# EAGLE design LimitSwitch (EAGLE 9.4.2)
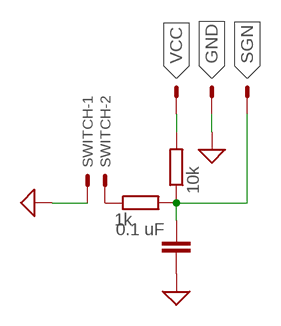
[diagram p0: schematic, sheet 1]

## Parts
C1  0.1 uF  C-EUC1206  [C1206]
INPUT  22-23-2031  [22-23-2031]
R3  10k  R-EU_R1206  [R1206]
R4  1k  R-EU_R1206  [R1206]
SWITCH  22-23-2021  [22-23-2021]

## Nets
GND: C1.2 INPUT.2 SWITCH.1 ; supply symbol labelled SUP
N$1: R4.1 SWITCH.2
SGN: C1.1 INPUT.3 R3.1 R4.2
VCC: INPUT.1 R3.2

## Library data of the parts
C1 = rcl:C-EU: CAPACITOR, European symbol; SPICEPREFIX: C
INPUT = con-molex:22-23-2031: .100" (2.54mm) Center Header - 3 Pin; MF: MOLEX; MPN: 22-23-2031; OC_FARNELL: 1462950; OC_NEWARK: 30C0862
R3 R4 = rcl:R-EU_: RESISTOR, European symbol; SPICEPREFIX: R
SWITCH = con-molex:22-23-2021: .100" (2.54mm) Center Header - 2 Pin; MF: MOLEX; MPN: 22-23-2021; OC_FARNELL: 1462926; OC_NEWARK: 25C3832

## Board
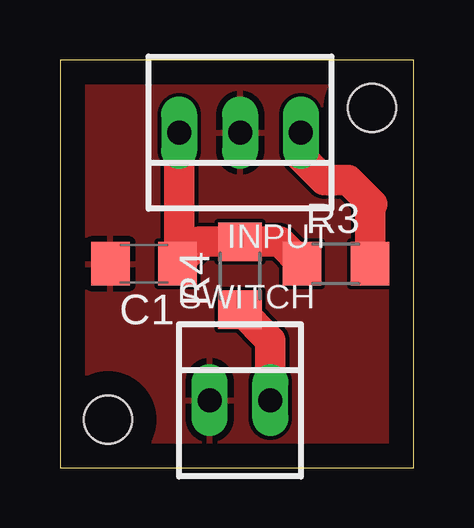
[diagram p1: board, top side]

Size 14.73 x 17 mm. Coordinates in mm from the lower left corner, seen from the top.
Outline: 0,0 14.73,0 14.73,16.99 0,17 0,0
Copper layers (1*16): Top 0.035mm / dielectric 1.5mm / Bottom 0.035mm
Design rules "default": minimum track width 6mil, minimum drill 0.35mm, track to track 6mil, track to pad 6mil, pad to pad 6mil, via to via 6mil, smd to smd 6mil, copper to edge 40mil, drill to drill 6mil, minimum pad ring 10mil, minimum via ring 8mil, stop-mask expansion 4mil, vias tented up to drill 0mil, thermal gap 10mil
Holes 2 mm at 2,2 13,15

### Footprints (pad centres in the part's own frame; a part is rotated, then mirrored left to right if it is on the bottom)
C1206 = smd 1.6 x 1.8: 1 -1.4,0; 2 1.4,0
22-23-2031 = drill 1 long: 1 -2.54,0; 2 0,0; 3 2.54,0
R1206 = smd 1.6 x 1.803: 1 -1.422,0; 2 1.422,0
22-23-2021 = drill 1 long: 1 -1.27,0; 2 1.27,0

### Placement (x,y rotation side)
C1  3.5,8.5 180 top
INPUT  7.5,13.97 180 top
R3  11.5,8.5 0 top
R4  7.5,8 90 top
SWITCH  7.5,2.81 0 top

### Tracks (layer width: path | path; a pad name or v marks a point on that pad's centre or on a via)
GND
  pour Top: -3,17 -3,21 -1,23 1,23 33,23 35,21 35,-1 33,-3 -2,-3 -3,-2
N$1
  Top 1.27: R4.1 8.77,5.31 SWITCH.2
SGN
  Top 1.27: INPUT.3 4.96,8.56 C1.1 5.82,9.42 R4.2 9.16,9.42 R3.1
VCC
  Top 1.27: INPUT.1 10,13.93 10,13 11,12 12,12 13,11 12.92,10.92 R3.2